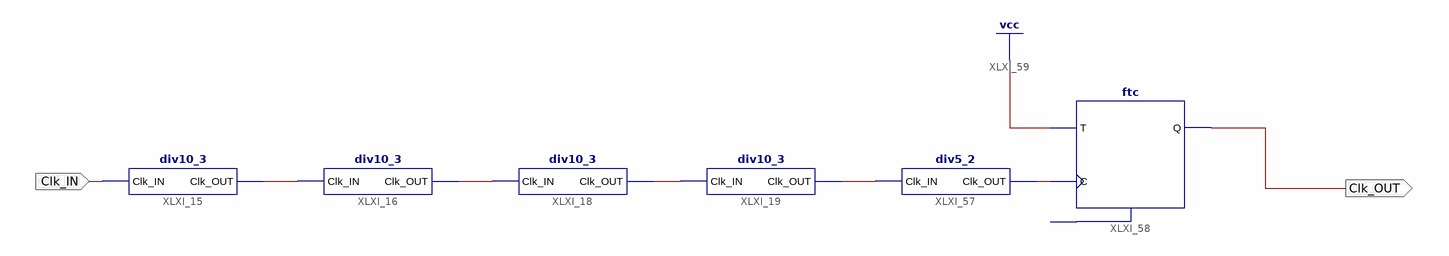
[diagram p0: schematic sheet 1]
// Xilinx ISE schematic DivideClk.sch (spartan6) as structural Verilog: 6 symbols, 2 ports
module DivideClk (
  input  Clk_IN,
  output Clk_OUT
);

  wire XLXN_5, XLXN_6, XLXN_7, XLXN_8, XLXN_63;

  div10_3 XLXI_19 (.Clk_IN(XLXN_7), .Clk_OUT(XLXN_8));
  div10_3 XLXI_18 (.Clk_IN(XLXN_6), .Clk_OUT(XLXN_7));
  div10_3 XLXI_16 (.Clk_IN(XLXN_5), .Clk_OUT(XLXN_6));
  div10_3 XLXI_15 (.Clk_IN(Clk_IN), .Clk_OUT(XLXN_5));
  div5_2 XLXI_57 (.Clk_IN(XLXN_8), .Clk_OUT(XLXN_63));
  ftc XLXI_58 (.C(XLXN_63), .T(1'b1), .Q(Clk_OUT));  // open: CLR
endmodule
